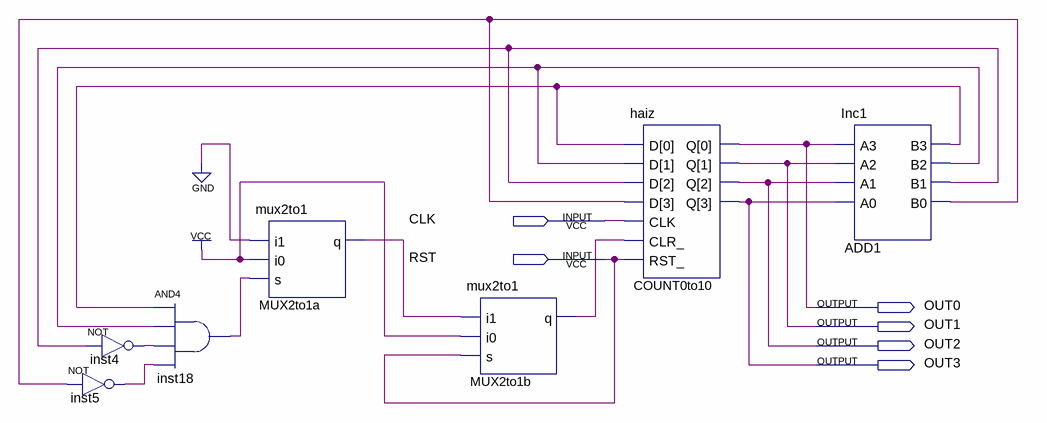
[diagram p0: schematic sheet]
// Quartus schematic Block2.bdf as structural Verilog: 7 symbols, 6 pins
module Block2 (
  input  CLK,
  input  RST,
  output OUT0,
  output OUT1,
  output OUT2,
  output OUT3
);

  wire ADD1_b0, ADD1_b1, ADD1_b2, ADD1_b3, inst4_out, inst5_out, inst18_out, MUX2to1a_q, MUX2to1b_q;

  not inst5 (inst5_out, ADD1_b0);
  and inst18 (inst18_out, ADD1_b3, ADD1_b2, inst4_out, inst5_out);
  not inst4 (inst4_out, ADD1_b1);
  mux2to1 MUX2to1a (.i1(1'b0), .i0(1'b1), .s(inst18_out), .q(MUX2to1a_q));
  mux2to1 MUX2to1b (.i1(MUX2to1a_q), .i0(1'b1), .s(RST), .q(MUX2to1b_q));
  haiz COUNT0to10 (
    .D({ADD1_b0, ADD1_b1, ADD1_b2, ADD1_b3}), .CLK(CLK), .CLR_(MUX2to1b_q), .RST_(RST),
    .Q({OUT3, OUT2, OUT1, OUT0}));
  Inc1 ADD1 (.A3(OUT0), .A2(OUT1), .A1(OUT2), .A0(OUT3), .B3(ADD1_b3), .B2(ADD1_b2), .B1(ADD1_b1), .B0(ADD1_b0));
endmodule
